# EAGLE design USBTINYISP (EAGLE 7.6.0)
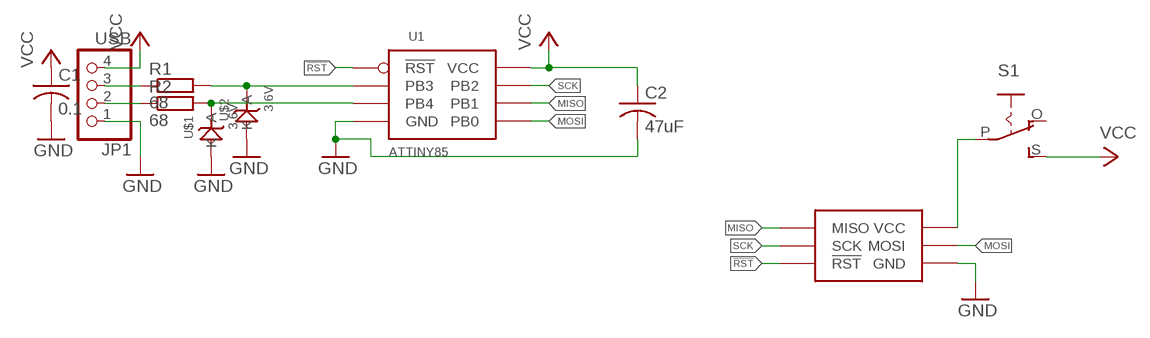
[diagram p0: schematic, sheet 1]

## Parts
C1  0.1  C-US025-025X050  [C025-025X050]
C2  47uF  C-US025-025X050  [C025-025X050]
ICSP1  AVRISCP  [AVRICSP]
JP1  USB  PINHD-1X4  [1X04]
R1  68  R-EU_0207/7  [0207/7]
R2  68  R-EU_0207/7  [0207/7]
S1  EG1218S  [EG1218]
U1  ATTINY85  [DIP8]
U$1  3.6V  Z3V6  [Z3V6]
U$2  3.6V  Z3V6  [Z3V6]

## Nets
!RST: ICSP1.P$5(!RST) U1.P$1(!RST)
GND: C1.2 C2.2 ICSP1.P$6(GND) JP1.1 U1.P$4(GND) U$1.P$2(A) U$2.P$2(A)
MISO: ICSP1.P$1(MISO) U1.P$6(PB1)
MOSI: ICSP1.P$4(MOSI) U1.P$5(PB0)
N$1: JP1.3 R1.1
N$2: JP1.2 R2.1
N$3: R2.2 U1.P$3(PB4) U$1.P$1(K)
N$4: R1.2 U1.P$2(PB3) U$2.P$1(K)
N$5: ICSP1.P$2(VCC) S1.P
SCK: ICSP1.P$3(SCK) U1.P$7(PB2)
VCC: C1.1 C2.1 JP1.4 S1.S U1.P$8(VCC)
Unconnected: S1.O

## Library data of the parts
C1 C2 = resistor:C-US: CAPACITOR, American symbol
ICSP1 = Arpit's Lib:AVRISCP
JP1 = pinhead:PINHD-1X4: PIN HEADER
R1 R2 = resistor:R-EU_: RESISTOR, European symbol
S1 = adafruit:EG1218: SLIDING SWITCH 0.1" spacing through hole, vertical SPDT slide switch http://www.ladyada.net/library/pcb/eaglelibrary.html
U1 = Arpit's Lib:ATTINY85
U$1 U$2 = Arpit's Lib:Z3V6

## Board
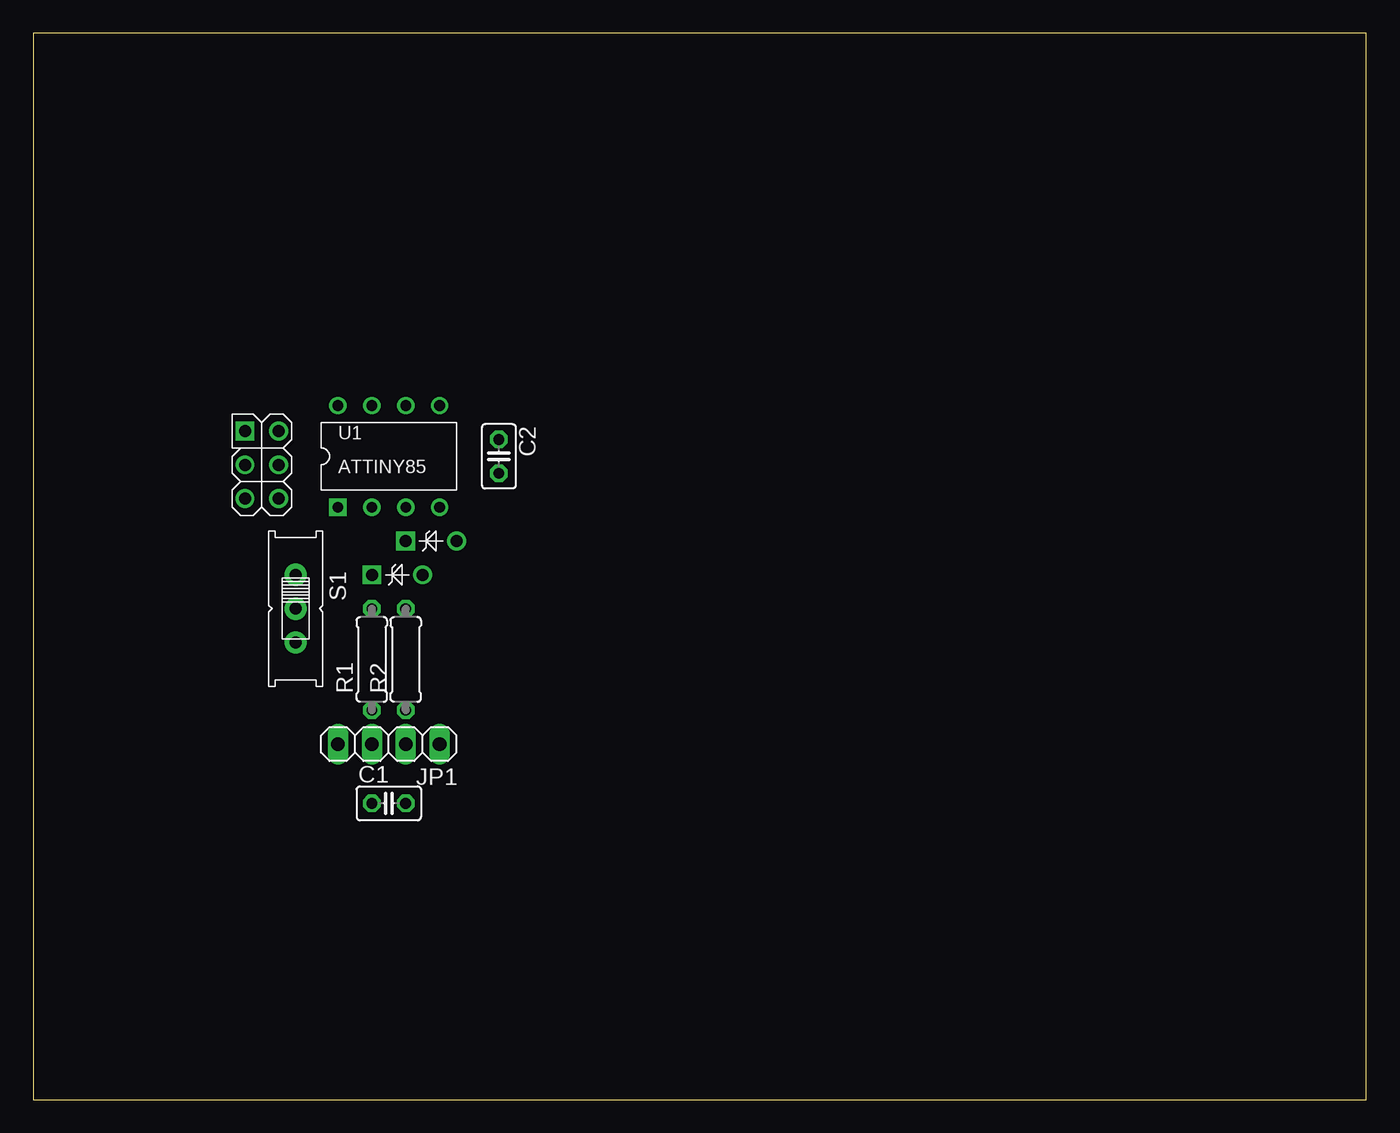
[diagram p1: board, top side]
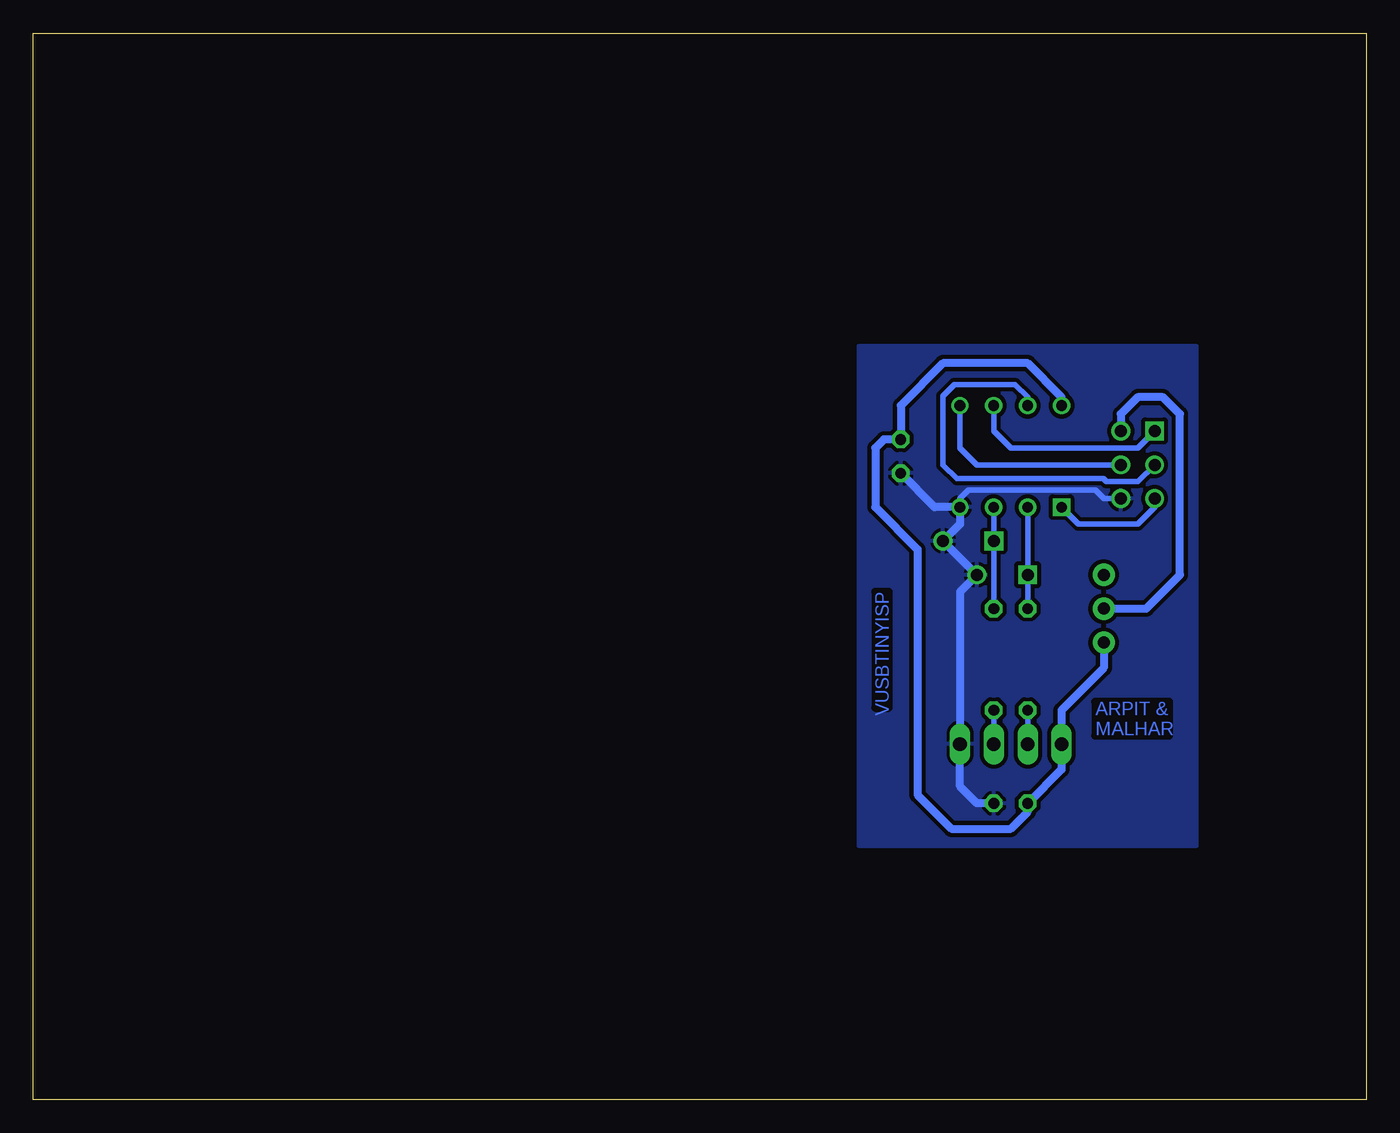
[diagram p2: board, bottom side, seen from below]

Size 100 x 80 mm. Coordinates in mm from the lower left corner, seen from the top.
Outline: 0,0 100,0 100,80 0,80 0,0
Copper layers (1*16): Top 0.035mm / dielectric 1.5mm / Bottom 0.035mm
Design rules "default": minimum track width 10mil, minimum drill 24mil, track to track 8mil, track to pad 8mil, pad to pad 8mil, via to via 8mil, smd to smd 8mil, copper to edge 40mil, drill to drill 8mil, minimum pad ring 10mil, minimum via ring 8mil, stop-mask expansion 4mil, vias tented up to drill 0mil, thermal gap 10mil

### Footprints (pad centres in the part's own frame; a part is rotated, then mirrored left to right if it is on the bottom)
C025-025X050 = drill 0.813 octagon: 1 -1.27,0; 2 1.27,0
AVRICSP = drill 0.9 square: P$1 0,0 | drill 0.9: P$2 0,2.54; P$3 2.54,0; P$4 2.54,2.54; P$5 5.08,0; P$6 5.08,2.54
1X04 = drill 1.016 long: 1 -3.81,0; 2 -1.27,0; 3 1.27,0; 4 3.81,0
0207/7 = drill 0.813 octagon: 1 -3.81,0; 2 3.81,0
EG1218 = drill 0.9 pad 1.676: O -2.54,0; P 0,0; S 2.54,0
DIP8 = drill 0.8 square: P$1 -3.81,-3.81 | drill 0.8: P$2 -1.27,-3.81; P$3 1.27,-3.81; P$4 3.81,-3.81; P$5 3.81,3.81; P$6 1.27,3.81; P$7 -1.27,3.81; P$8 -3.81,3.81
Z3V6 = drill 0.9 square: P$1 -1.27,0 | drill 0.9: P$2 2.54,0

### Placement (x,y rotation side)
C1  26.67,22.23 0 top
C2  34.92,48.26 270 top
ICSP1  15.88,50.16 270 top
JP1  26.67,26.67 180 top
R1  25.4,33.02 90 top
R2  27.94,33.02 90 top
S1  19.68,36.83 270 top
U1  26.67,48.26 0 top
U$1  29.21,41.91 0 top
U$2  26.67,39.37 0 top

### Tracks (layer width: path | path; a pad name or v marks a point on that pad's centre or on a via)
!RST
  Bottom 0.406: U1.P$1 21.59,43.18 17.14,43.18 15.88,44.45 ICSP1.P$5
GND
  Bottom 0.406: U1.P$4 30.48,45.09 29.84,45.72 20.32,45.72 19.68,45.09 ICSP1.P$6
  Bottom 0.61: C1.2 29.21,22.23 30.48,23.5 JP1.1 30.48,38.1 U$2.P$2 U$1.P$2 30.48,43.18 U1.P$4 32.38,44.45 C2.2
  pour Bottom (isolate 0.305): 12.7,56.52 38.1,56.52 38.1,19.05 12.7,19.05
MISO
  Bottom 0.406: U1.P$6 27.94,50.16 26.67,48.9 17.14,48.9 ICSP1.P$1
MOSI
  Bottom 0.406: ICSP1.P$4 29.21,47.62 30.48,48.9 U1.P$5
N$1
  Bottom 0.406: R1.1 JP1.3
N$2
  Bottom 0.406: R2.1 JP1.2
N$3
  Bottom 0.406: U1.P$3 U$1.P$1 R2.2
N$4
  Bottom 0.406: R1.2 U$2.P$1 U1.P$2
N$5
  Bottom 0.61: S1.P 16.51,36.83 13.97,39.37 13.97,51.44 15.24,52.7 17.14,52.7 18.41,51.44 ICSP1.P$2
SCK
  Bottom 0.406: ICSP1.P$3 17.14,46.35 19.48,46.35 19.71,46.58 30.71,46.58 31.75,47.62 31.75,52.78 30.89,53.65 26.34,53.65 25.4,52.7 U1.P$7
VCC
  Bottom 0.61: S1.S 19.68,32.38 22.86,29.21 JP1.4 22.86,24.77 C1.1 25.4,21.59 26.67,20.32 31.11,20.32 33.66,22.86 33.66,41.27 36.83,44.45 36.83,48.9 36.2,49.53 C2.1 34.92,52.07 31.75,55.24 25.4,55.24 22.86,52.7 U1.P$8

### Text on the board
Bottom: VUSBTINYISP | ARPIT & / MALHAR